# Altium schematic sheet TLM_002_INA228.SchDoc: =DocumentName
size A4; CompanyName: Scopa Industries LLC; Engineer: Nazar Lysenko / Andrii Antonenko; Organization: Scopa Industries LLC; Address1: Kyiv; Address2: Ukraine; Address3: https://www.scopa.industries/; Address4: oleksyi.y@scopa.industries; SheetNumber: 5; SheetTotal: 11
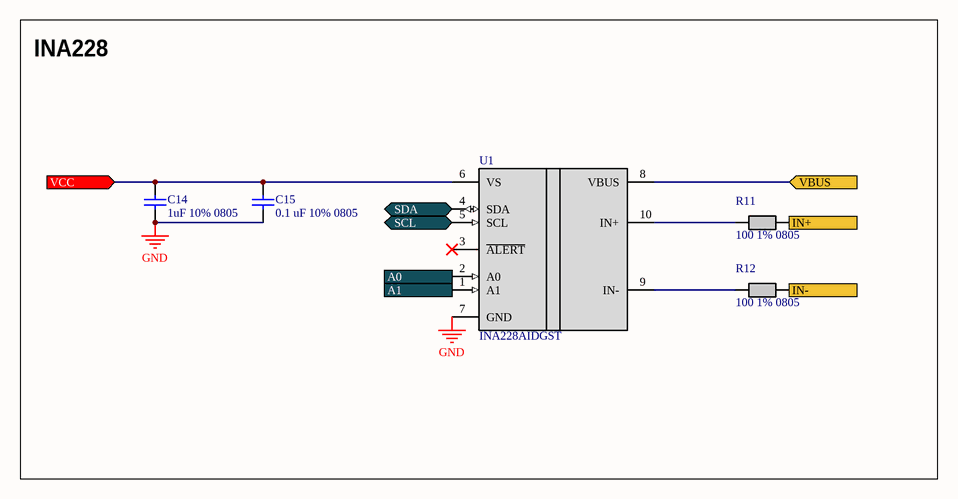
[diagram p0: TLM_002_INA228.SchDoc]

## Parts
C14  1uF 10% 0805  [CAPC2013X145X50NL20T20]
C15  0.1 uF 10% 0805  [CAPC2013X140X50ML20T25]
R11  100 1% 0805  [RES_0805]
R12  100 1% 0805  [RES_0805]
U1  INA228AIDGST  [FP-DGS0010A-IPC_C]

## Ports
A0 (in, see TLM_002_MBR[2C]), A1 (in, see TLM_002_MBR[2C]), IN+ (in, see TLM_002_MBR[2C]), IN- (in, see TLM_002_MBR[2C]), SCL (bidir, see TLM_002_MBR[2C], TLM_002_CONNECT[1B], TLM_002_DS3231SN_RTC[2B], TLM_002_ESP32S3[2B], TLM_002_MCP3021[4B]), SDA (bidir, see TLM_002_MBR[2C], TLM_002_CONNECT[1B], TLM_002_DS3231SN_RTC[2B], TLM_002_ESP32S3[2B], TLM_002_MCP3021[3B]), VBUS (in, see TLM_002_MBR[2C]), VCC (in, see TLM_002_MBR[2C], TLM_002_DS3231SN_RTC[2B], TLM_002_ESP32S3[1A], TLM_002_LoRa[2B], TLM_002_MAX6675[2B], TLM_002_MAX31856[1B], TLM_002_MCP3021[3B], TLM_002_SD[1B])

## Nets
GND: C14.1 C15.1 U1.7(GND)
A0: U1.2(A0) ; port A0
A1: U1.1(A1) ; port A1
IN+: R11.2 ; port IN+
IN-: R12.2 ; port IN-
SCL: U1.5(SCL) ; port SCL
SDA: U1.4(SDA) ; port SDA
VBUS: U1.8(VBUS) ; port VBUS
VCC: C14.2 C15.2 U1.6(VS) ; port VCC
NetR11_1: R11.1 U1.10(IN+)
NetR12_1: R12.1 U1.9(IN-)

Not connected (* = marked no-connect by the designer): U1 3(~{ALERT})*

## Notes on the sheet
- INA228
- Title
- Size:
- Date:
- A4
- Author:
- Time:
- Sheet
- Revision:
- of
- File:

## Library data of the parts
C14 = CMP-2007-01676-1: Part Number: VJ0805Y105KXQRW1BC; Manufacturer: Vitramon
C15 = CMP-2007-04651-1: Part Number: 0805DD104KAT2A; Manufacturer: AVX Interconnect / Elco
R11 R12 = Resistor_100: Resistor 100Ohm 1% SMD 0805 Generic; Value: 100; Package size: 0805; Tolerance: 1%
U1 = CMP-019-00049-1: IC PWR MONITOR 10VSSOP Power Supply Controller Digital Power Monitor 10-VSSOP